# Altium project LM-002.PrjPcb
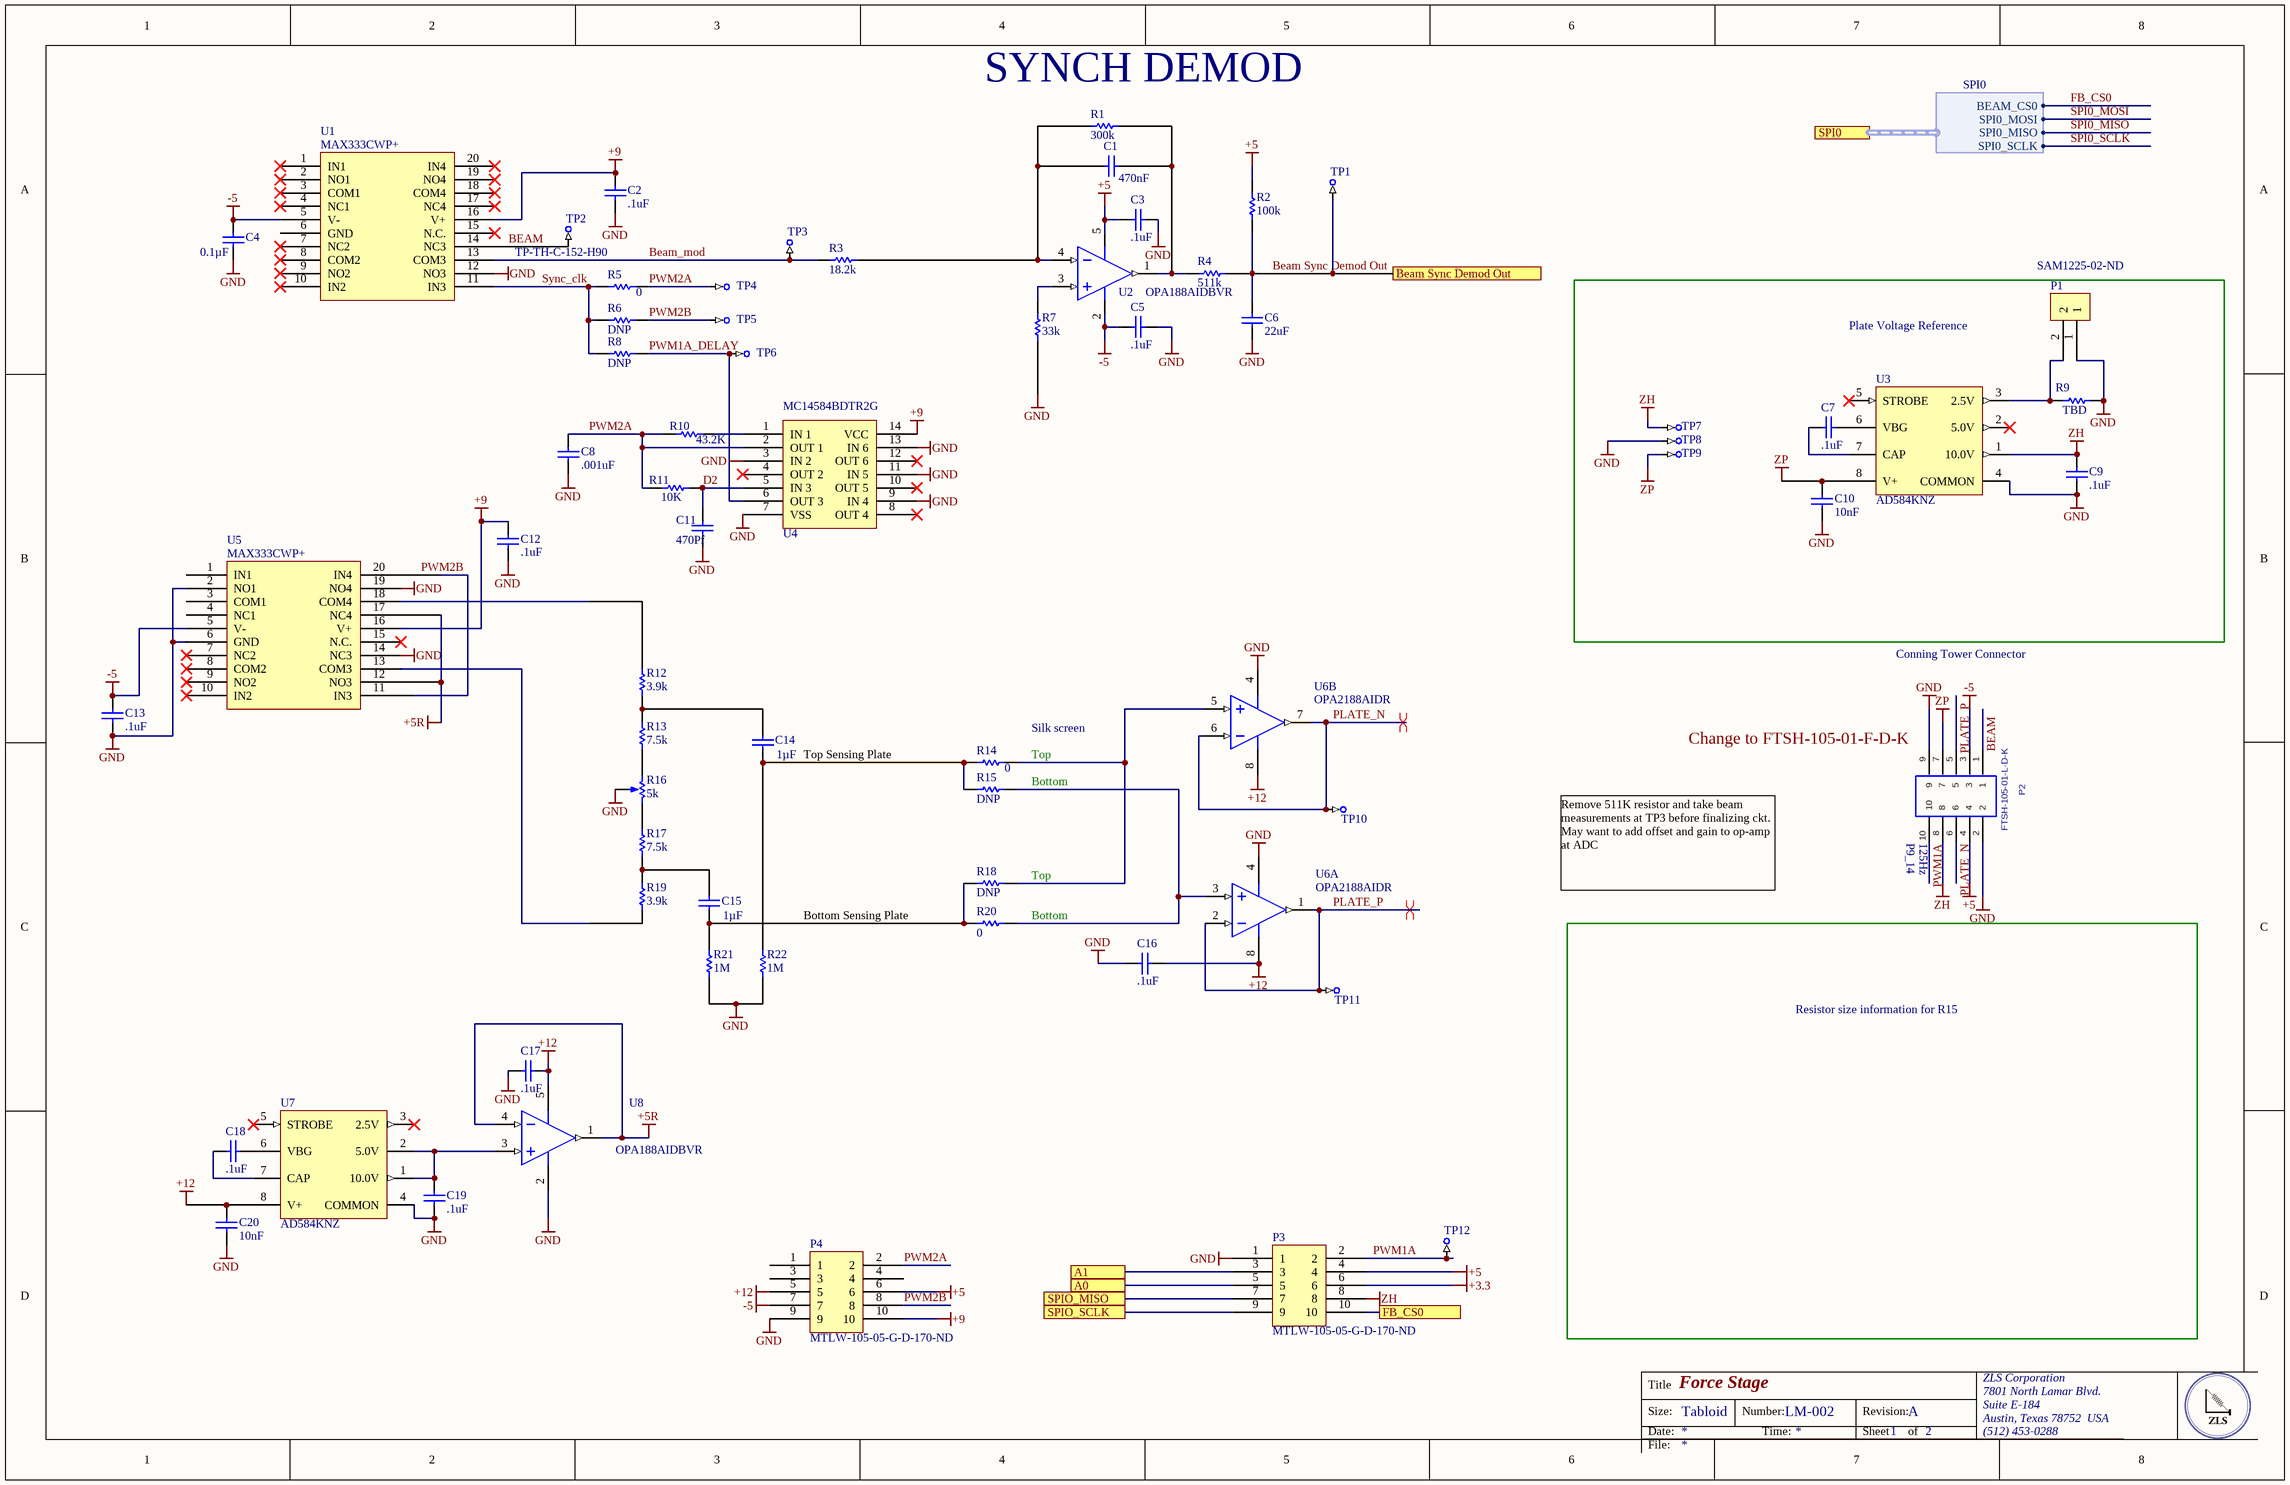
[diagram p0: Sheet1.SchDoc]
1 sheet, 66 parts. Net scope: flat (ports and power ports of the same name join across sheets).
Board file: PCB1.PcbDoc

## Sheet Sheet1.SchDoc: Force Stage
size Tabloid; DocumentNumber: LM-002; Revision: A; SheetNumber: 1; SheetTotal: 2; DocumentName: LM-002; ProjectName: LM-002

### Parts
C1  470nF  [CAPC0805(2012)75_L]
C2  .1uF  [CAPC0805(2012)75_L]
C3  .1uF  [CAPC0805(2012)75_L]
C4  Capacitance: 0.1µF  [CAPC0805(2012)145_N]  (hidden comment: CAP CER 0.1UF 25V X7R 0805)
C5  .1uF  [CAPC0805(2012)75_L]
C6  22uF  [CAPC0805(2012)75_L]
C7  .1uF  [CAPC0805(2012)75_M]
C8  .001uF  [CAPC0805(2012)75_L]
C9  .1uF  [CAPC0805(2012)75_M]
C10  Capacitance: 10nF  [CAPC0805(2012)145_N]  (hidden comment: Multilayer Ceramic Capacitors MLCC - SMD/SMT 0.01uF 50volts 10% X7R)
C11  470Pf  [CAPC0805(2012)75_L]
C12  .1uF  [CAPC0805(2012)75_M]
C13  .1uF  [CAPC0805(2012)75_M]
C14  Capacitance: 1µF  [CAPC0805(2012)155_L]  (hidden comment: CAP CER 1UF 25V X7R 0805)
C15  Capacitance: 1µF  [CAPC0805(2012)155_L]  (hidden comment: CAP CER 1UF 25V X7R 0805)
C16  .1uF  [CAPC0805(2012)75_M]
C17  .1uF  [CAPC0805(2012)75_M]
C18  .1uF  [CAPC0805(2012)75_M]
C19  .1uF  [CAPC0805(2012)75_M]
C20  Capacitance: 10nF  [CAPC0805(2012)145_N]  (hidden comment: Multilayer Ceramic Capacitors MLCC - SMD/SMT 0.01uF 50volts 10% X7R)
P1  Supplier Part Number 1: SAM1225-02-ND  [SSW-102-02-G-S-RA]  (hidden comment: SSW-102-02-G-S-RA)
P2  FTSH-105-01-L-D-K  [FTSH-105-01-XXX-D-K]
P3  Supplier Part Number 1: MTLW-105-05-G-D-170-ND  [TLW-105-05-G-D]  (hidden comment: TLW-105-05-G-D)
P4  Supplier Part Number 1: MTLW-105-05-G-D-170-ND  [TLW-105-05-G-D]  (hidden comment: TLW-105-05-G-D)
R1  300k  [RESC0805(2012)_L]
R2  100k  [RESC0805(2012)_L]
R3  18.2k  [RESC0805(2012)_L]
R4  511k  [RESC0805(2012)_L]
R5  0  [RESC0805(2012)_L]
R6  DNP  [RESC0805(2012)_L]
R7  33k  [RESC0805(2012)_L]
R8  DNP  [RESC0805(2012)_L]
R9  TBD  [VH102K]
R10  43.2K  [RESC0805(2012)_L]
R11  10K  [RESC0805(2012)_L]
R12  3.9k  [RESC0805(2012)_L]
R13  7.5k  [RESC0805(2012)_L]
R14  0  [RESC0805(2012)_L]
R15  DNP  [RESC0805(2012)_L]
R16  Resistance (Ohms): 5k  [Trimmer 2.54]  (hidden comment: TRIMMER 5K OHM 0.25W PC PIN)
R17  7.5k  [RESC0805(2012)_L]
R18  DNP  [RESC0805(2012)_L]
R19  3.9k  [RESC0805(2012)_L]
R20  0  [RESC0805(2012)_L]
R21  1M  [RESC0805(2012)_L]
R22  1M  [RESC0805(2012)_L]
TP1  TP-TH-C-152-H90  [TP-TH-C-152-H90]  (value not drawn)  (no BOM)
TP2  TP-TH-C-152-H90  [TP-TH-C-152-H90]  (no BOM)
TP3  TP-TH-C-152-H90  [TP-TH-C-152-H90]  (value not drawn)  (no BOM)
TP4  TP-TH-C-152-H90  [TP-TH-C-152-H90]  (value not drawn)  (no BOM)
TP5  TP-TH-C-152-H90  [TP-TH-C-152-H90]  (value not drawn)  (no BOM)
TP6  TP-TH-C-152-H90  [TP-TH-C-152-H90]  (value not drawn)  (no BOM)
TP7  TP-TH-C-152-H90  [TP-TH-C-152-H90]  (value not drawn)  (no BOM)
TP8  TP-TH-C-152-H90  [TP-TH-C-152-H90]  (value not drawn)  (no BOM)
TP9  TP-TH-C-152-H90  [TP-TH-C-152-H90]  (value not drawn)  (no BOM)
TP10  TP-TH-C-152-H90  [TP-TH-C-152-H90]  (value not drawn)  (no BOM)
TP11  TP-TH-C-152-H90  [TP-TH-C-152-H90]  (value not drawn)  (no BOM)
TP12  TP-TH-C-152-H90  [TP-TH-C-152-H90]  (value not drawn)  (no BOM)
U1  MAX333CWP+  [TSOP65P640X90-20N]
U2  OPA188AIDBVR  [DBV0005A_M]
U3  AD584KNZ  [ADI-N-8]
U4  MC14584BDTR2G  [MC14584BDTR2G]
U5  MAX333CWP+  [TSOP65P640X90-20N]
U6  OPA2188AIDR  [D0008A_L]  (parts A,B of 2)
U7  AD584KNZ  [ADI-N-8]
U8  OPA188AIDBVR  [DBV0005A_M]

### Blocks framed on the sheet
Plate Voltage Reference: C7 C9 C10 P1 R9 TP7-TP9 U3

### Ports
A0, A1, Beam Sync Demod Out, FB_CS0, SPI0 (harness SPI0), SPIO_MISO, SPIO_SCLK

### Harnesses
SPI0: BEAM_CS0, SPI0_MOSI, SPI0_MISO, SPI0_SCLK

### Nets
+3.3: P3.6
+5: C3.1 P2.4 P3.4 P4.6 R2.2 U2.5(V+)
+5R: U5.12(NO3) U5.17(NC4) U8.1(OUT) U8.4(IN-)
+9: C2.2 C12.2 P4.10 U1.16(V+) U4.14(VCC) U5.16(V+)
+12: C16.2 C17.2 C20.1 P4.5 U6.8(V+) U7.8(V+) U8.5(V+)
-5: C4.1 C5.1 C13.2 P2.3 P4.7 U1.5(V-) U2.2(V-) U5.5(V-)
GND: C2.1 C3.2 C4.2 C5.2 C6.1 C8.1 C9.1 C10.2 C11.1 C12.1 C13.1 C16.1 C17.1 C19.1 C20.2 P1.1 P2.2 P2.9 P3.1 P4.9 R7.1 R9.2 R16.2(b) R21.1 R22.1 TP8.1 U1.12(NO3) U3.4(COMMON) U4.3(IN_2) U4.7(VSS) U4.9(IN_4) U4.11(IN_5) U4.13(IN_6) U5.2(NO1) U5.6(GND) U5.14(NC3) U5.19(NO4) U6.4(V-) U7.4(COMMON) U8.2(V-)
ZH: C9.2 P2.8 P3.8 TP7.1 U3.1(10.0V)
ZP: C10.1 P2.7 TP9.1 U3.8(V+)
BEAM: P2.1 TP2.1 U1.14(NC3)
Beam Sync Demod Out: C6.2 R2.1 R4.1 TP1.1 ; port Beam Sync Demod Out
Beam_mod: R3.2 TP3.1 U1.13(COM3)
D2: C11.2 R11.1 U4.5(IN_3)
FB_CS0: port SPI0.BEAM_CS0
PLATE_N: P2.6 TP10.1 U6.6(IN_B-) U6.7(OUT_B)
PLATE_P: P2.5 TP11.1 U6.1(OUT_A) U6.2(IN_A-)
PWM1A: P2.10 P3.2 TP12.1
PWM1A_DELAY: R8.1 TP6.1 U4.6(OUT_3)
PWM2A: C8.2 P4.2 R5.1 R10.2 R11.2 TP4.1 U4.2(OUT_1)
PWM2B: P4.8 R6.1 TP5.1 U5.11(IN3) U5.20(IN4)
SPI0_MISO: port SPI0.SPI0_MISO
SPI0_MOSI: port SPI0.SPI0_MOSI
SPI0_SCLK: port SPI0.SPI0_SCLK
Sync_clk: R5.2 R6.2 R8.2 U1.11(IN3)
NetC1_1: C1.1 R1.2 R3.1 U2.4(IN-)
NetC1_2: C1.2 R1.1 R4.2 U2.1(OUT)
NetC7_1: C7.1 U3.7(CAP)
NetC7_2: C7.2 U3.6(VBG)
NetC14_1: C14.1 R14.2 R15.2 R22.2
NetC14_2: C14.2 R12.1 R13.2
NetC15_1: C15.1 R18.2 R20.2 R21.2
NetC15_2: C15.2 R17.1 R19.2
NetC18_1: C18.1 U7.7(CAP)
NetC18_2: C18.2 U7.6(VBG)
NetC19_2: C19.2 U7.1(10.0V) U7.2(5.0V) U8.3(IN+)
NetP1_2: P1.2 R9.1 U3.3(2.5V)
NetP3_3: P3.3 ; port A1
NetP3_5: P3.5 ; port A0
NetP3_7: P3.7 ; port SPIO_MISO
NetP3_9: P3.9 ; port SPIO_SCLK
NetP3_10: P3.10 ; port FB_CS0
NetR7_2: R7.2 U2.3(IN+)
NetR10_1: R10.1 U4.1(IN_1)
NetR12_2: R12.2 U5.18(COM4)
NetR13_1: R13.1 R16.1(a)
NetR14_1: R14.1 R18.1 U6.5(IN_B+)
NetR15_1: R15.1 R20.1 U6.3(IN_A+)
NetR16_3: R16.3(c) R17.2
NetR19_1: R19.1 U5.13(COM3)

Not connected (* = marked no-connect by the designer): P4 1 3 4; U1 1(IN1)* 2(NO1)* 3(COM1)* 4(NC1)* 6(GND) 7(NC2)* 8(COM2)* 9(NO2)* 10(IN2)* 15(N.C.)* 17(NC4)* 18(COM4)* 19(NO4)* 20(IN4)*; U3 2(5.0V)* 5(STROBE)*; U4 4(OUT_2)* 8(OUT_4)* 10(OUT_5)* 12(OUT_6)*; U5 1(IN1) 3(COM1) 4(NC1) 7(NC2)* 8(COM2)* 9(NO2)* 10(IN2)* 15(N.C.)*; U7 3(2.5V)* 5(STROBE)*

### Layout directives
differential pair: PLATE_N, PLATE_P

### Notes on the sheet
- (near R1) SYNCH DEMOD
- Conning Tower Connector
- (near C14) Top Sensing Plate
- Silk screen
- Top
- (near P2) Change to FTSH-105-01-F-D-K
- Bottom
- (near P2) P9_14
- (near P2) 125Hz
- (near R18) Top
- Remove 511K resistor and take beam measurements at TP3 before finalizing ckt.
  May want to add offset and gain to op-amp at ADC
- Bottom Sensing Plate
- Resistor size information for R15
- Title
- Size:
- Date:
- Tabloid
- Number:
- Time:
- Revision:
- Sheet
- of
- ZLS Corporation
- 7801 North Lamar Blvd.
- Suite E-184
- Austin, Texas 78752  USA
- (512) 453-0288
- File:

### Library data of the parts
C1 = CMP-1036-02117-1: CAP 150pF 16V ±10% 0805 (2012 Metric) Thickness 0.75mm SMD; Case-EIA: 0805; Tolerance: Â±10%; Value: .47uF; Case-Metric: 2012; Technology: SMT; Max Thickness: 0.75 mm; Rated Voltage: 16 V
C2 C3 C5 C6 C8 C11 = CMP-1036-02117-1: CAP 150pF 16V ±10% 0805 (2012 Metric) Thickness 0.75mm SMD; Case-EIA: 0805; Tolerance: Â±10%; Case-Metric: 2012; Technology: SMT; Max Thickness: 0.75 mm; Rated Voltage: 16 V
  C2 C3 C5: Value: .1uF
  C6: Value: 22uF
  C8: Value: .001uF
  C11: Value: 470Pf
C4 = CMP-1036-04795-1: Manufacturer: Murata Electronics North America; Manufacturer Part Number: GRM21BR71E104KA01L; Tolerance: ±10%; Supplier 1: Digi-Key; Supplier Part Number 1: 490-1673-6-ND; RoHS: RoHS Compliant; Category: Capacitors; Stock 1: 891652; Pricing 1: 1=0.2, 10=0.145, 100=0.0683, 500=0.04788, 1000=0.03964 (USD); Packaging: Digi-Reel®; Part Status: Active; Voltage - Rated: 25V; Temperature Coefficient: X7R; Operating Temperature: -55°C ~ 125°C; Features: -; Ratings: -; Applications: General Purpose; Mounting Type: Surface Mount, MLCC; Package / Case: 0805 (2012 Metric); Size / Dimension: 0.079" L x 0.049" W (2.00mm x 1.25mm); Height - Seated (Max): -; Thickness (Max): 0.053" (1.35mm); Lead Spacing: -; Lead Style: -; ComponentLink1URL: http://www.murata.com/~/media/webrenewal/support/library/catalog/products/capacitor/mlcc/c02e.ashx; ComponentLink1Description: http://www.murata.com/~/media/webrenewal/support/library/catalog/products/capacitor/mlcc/c02e.ashx
C7 C9 C12 C13 C16-C19 = CMP-1036-01414-1: CAP 33pF 25V ±2% 0805 (2012 Metric) Thickness 0.75mm SMD; Tolerance: Â±2%; Case-Metric: 2012; Case-EIA: 0805; Value: .1uF; Max Thickness: 0.75 mm; Rated Voltage: 25 V; Technology: SMT
C10 C20 = CMP-1036-04795-1: Manufacturer: Kemet; Manufacturer Part Number: C0805C103K5RACAUTO; Voltage Rating: 50V; Supplier 1: Digi-Key; Supplier Part Number 1: 399-6924-1-ND; Stock 1: 63236; Pricing 1: 1=0.12, 10=0.087, 100=0.041, 500=0.0287, 1000=0.0238 (USD); Mount: Surface Mount; Case/Package: 0805; Case Code (Metric): 2012; Case Code (Imperial): 0805; Dielectric Material: Ceramic; Contact Plating: Tin; Min Operating Temperature: -55°C; Max Operating Temperature: 125°C; Tolerance: 10%; Packaging: Tape and Reel; Package Quantity: 1; Voltage Rating (DC): 50V; Dielectric: X7R; Termination: SMD/SMT; Length: 2mm; Height: 0.78mm; Width: 0.049inch; Thickness: 0.035inch; Depth: 1.25mm; Radiation Hardening: No; REACH SVHC: No SVHC; ComponentLink1URL: https://datasheet.ciiva.com/22700/1693454-22700519.pdf; ComponentLink1Description: https://datasheet.ciiva.com/22700/1693454-22700519.pdf; ComponentLink2URL: https://datasheet.ciiva.com/7842/1693454-7842175.pdf; ComponentLink2Description: https://datasheet.ciiva.com/7842/1693454-7842175.pdf
C14 C15 = CMP-1036-04882-1: Manufacturer: Murata Electronics North America; Manufacturer Part Number: GRM21BR71E105KA99L; Tolerance: ±10%; Supplier 1: Digi-Key; Supplier Part Number 1: 490-6484-6-ND; RoHS: RoHS Compliant; Category: Capacitors; Stock 1: 295074; Pricing 1: 1=0.14, 10=0.099, 100=0.0468, 500=0.0328, 1000=0.02715 (USD); Packaging: Digi-Reel®; Part Status: Active; Voltage - Rated: 25V; Temperature Coefficient: X7R; Operating Temperature: -55°C ~ 125°C; Features: -; Ratings: -; Applications: General Purpose; Mounting Type: Surface Mount, MLCC; Package / Case: 0805 (2012 Metric); Size / Dimension: 0.079" L x 0.049" W (2.00mm x 1.25mm); Height - Seated (Max): -; Thickness (Max): 0.053" (1.35mm); Lead Spacing: -; Lead Style: -; ComponentLink1URL: http://www.murata.com/~/media/webrenewal/support/library/catalog/products/capacitor/mlcc/c02e.ashx; ComponentLink1Description: http://www.murata.com/~/media/webrenewal/support/library/catalog/products/capacitor/mlcc/c02e.ashx
P2 = FTSH-105-01-XXX-D-K: TERMINAL STRIP, .050"(1.27mm) PITCH, 10 PINS, KEYING OPTION.; MANUFACTURER: SAMTEC; PCB DECAL: FTSH-105-01-F-DV-K; CREATED: September 26, 2016 - Wendy Xin
P3 P4 = TLW-105-05-G-D: Manufacturer: Samtec Inc.; Manufacturer Part Number: MTLW-105-05-G-D-170; Connector Type: Header; Pitch - Mating: 0.100" (2.54mm); Number of Positions: 10; Number of Positions Loaded: All; Style: Board to Board or Cable; Shrouding: Unshrouded; Contact Length - Mating: 0.170" (4.32mm); Contact Length - Post: 0.105" (2.67mm); Overall Contact Length: 0.335" (8.51mm); Material Flammability Rating: UL94 V-0; Current Rating: 5.2A per Contact; Supplier 1: Digi-Key; RoHS: RoHS Compliant; Category: Connectors, Interconnects; Stock 1: 0; Pricing 1: 1=1.79 (USD); Packaging: Tube; Part Status: Active; Contact Type: Male Pin; Number of Rows: 2; Row Spacing - Mating: 0.100" (2.54mm); Mounting Type: Through Hole; Termination: Solder; Fastening Type: Push-Pull; Insulation Height: 0.060" (1.52mm); Contact Shape: Square; Contact Finish - Mating: Gold; Contact Finish Thickness - Mating: 10µin (0.25µm); Contact Finish - Post: Gold; Contact Material: Phosphor Bronze; Insulation Material: Liquid Crystal Polymer (LCP); Features: -; Operating Temperature: -55°C ~ 125°C; Ingress Protection: -; Insulation Color: Black; Voltage Rating: -; Mated Stacking Heights: -; Contact Finish Thickness - Post: 3µin (0.08µm); Applications: -; ComponentLink1URL: http://suddendocs.samtec.com/prints/mtlw-1xx-xx-xx-x-xxx-xx-xx-mkt1.pdf; ComponentLink1Description: http://suddendocs.samtec.com/prints/mtlw-1xx-xx-xx-x-xxx-xx-xx-mkt1.pdf
R1-R5 R7 R10-R14 R17 R19-R22 = CMP-1013-00215-1: 2R55 0.125W 1% 0805 (2012 Metric)  SMD; Case-Metric: 2012; Case-EIA: 0805; Tolerance: 1 %; Technology: SMT; Power: 0.125 W
  R1: Value: 300k
  R2: Value: 100k
  R3: Value: 18.2k
  R4: Value: 511k
  R5 R14 R20: Value: 0
  R7: Value: 33k
  R10: Value: 43.2K
  R11: Value: 10K
  R12 R19: Value: 3.9k
  R13 R17: Value: 7.5k
  R21 R22: Value: 1M
R6 R8 R15 R18 = CMP-1013-00215-1: 2R55 0.125W 1% 0805 (2012 Metric)  SMD; Case-Metric: 2012; Value: 0; Case-EIA: 0805; Tolerance: 1 %; Technology: SMT; Power: 0.125 W
R9 = CMP-1013-00393-1
R16 = Trimmer: Manufacturer: Vishay Foil Resistors (Division of Vishay Precision Group); Manufacturer Part Number: Y00535K00000J0L; Power (Watts): 0.25W, 1/4W; Tolerance: ±5%; Temperature Coefficient: ±10ppm/°C; Number of Turns: 21; Adjustment Type: Side Adjustment; Resistive Material: Metal Foil; Supplier 1: Digi-Key; Supplier Part Number 1: 804-1020-ND; RoHS: RoHS Compliant; Category: Potentiometers, Variable Resistors; Stock 1: 679; Pricing 1: 1=34.42, 10=32.265, 25=26.5292, 50=22.944, 100=22.227, 250=20.793, 500=19.2156 (USD); Packaging: Bulk; Part Status: Active; Mounting Type: Through Hole; Termination Style: PC Pins; Size / Dimension: Rectangular - 0.250" x 0.175" Face x 0.250" L (6.35mm x 4.45mm x 6.35mm); ComponentLink1URL: http://www.vishaypg.com/docs/63053/1240.pdf; ComponentLink1Description: http://www.vishaypg.com/docs/63053/1240.pdf
TP1-TP12 = CMP-0484-00003-2: Test Point, Through Hole, Hole Size 0.9 mm, PCB Mount with Silkscreen Box; Manufacturer: No Vendor; PartNumber: TP-TH-C-152-H90
U1 U5 = MAX333CWP+: IC SWITCH QUAD SPDT 20TSSOP; Manufacturer: Maxim; Manufacturer Part Number: MAX333AEUP+; Max Supply Voltage: 30V; Min Supply Voltage: 10V; Min Dual Supply Voltage: 4.5V; Max Dual Supply Voltage: 20V; On-State Resistance: 35R; Operating Supply Current: 1uA; Supply Type: Single,Dual; Max Power Dissipation: 559mW; Turn-On Delay Time: 175ns; Turn-Off Delay Time: 145ns; Max Supply Current: 250uA; Number of Bits: 4; Dual Supply Voltage: 15V; Supplier 1: Mouser; Supplier Part Number 1: 700-MAX333AEUP; Stock 1: 664; Pricing 1: 1=6.77, 10=6.43, 50=5.8, 100=5.8, 1000=5.62, 10000=5.62 (USD); Case/Package: TSSOP; Number of Pins: 20; Weight: 0.006737oz; Min Operating Temperature: -40°C; Max Operating Temperature: 85°C; Packaging: Rail/Tube; Package Quantity: 74; Throw Configuration: SPDT; Number of Channels: 4; Length: 6.6mm; Height: 0.95mm; Width: 4.5mm; Radiation Hardening: No; Lead Free: Lead Free; REACH SVHC: Unknown; ComponentLink1URL: https://datasheet.ciiva.com/2978/max333a-2978850.pdf; ComponentLink1Description: https://datasheet.ciiva.com/2978/max333a-2978850.pdf; ComponentLink2URL: https://datasheet.ciiva.com/30478/0900766b81253c85-30478260.pdf; ComponentLink2Description: https://datasheet.ciiva.com/30478/0900766b81253c85-30478260.pdf; ComponentLink3URL: https://datasheet.ciiva.com/1674/max333a-1674617.pdf; ComponentLink3Description: https://datasheet.ciiva.com/1674/max333a-1674617.pdf; ComponentLink4URL: https://datasheet.ciiva.com/26825/max333aeup-26825546.pdf; ComponentLink4Description: https://datasheet.ciiva.com/26825/max333aeup-26825546.pdf
U2 U8 = CMP-0809-00005-2: Precision, Low Noise, Rail-to-Rail Output, Zero-Drift Operational Amplifier, 4 to 36 V, -40 to 125 degC, 5-pin SOT23 (DBV5), Green (RoHS & no Sb/Br); Manufacturer: Texas Instruments; Total Supply Voltage(Min)(+5V is 5, +/-5V is 10): 4; Offset Drift(Typ)(uV/C): 0.03; Rating: Catalog; SubFamily: Zero Drift Precision Amplifier; GBW(Typ)(MHz): 2; Slew Rate(Typ)(V/us): 0.8; Number of Channels: 1; CMRR(Min)(dB): 120; Iq per channel(Max)(mA): 0.51; Total Supply Voltage(Max)(+5V is 5, +/-5V is 10): 36; PartNumber: OPA188AIDBVR; ComponentLink2Description: Datasheet; ComponentLink2URL: http://www.ti.com/lit/ds/symlink/opa188.pdf; ComponentLink1Description: Manufacturer URL; Mounting Technology: Surface Mount; Eco-Plan: Green (RoHS & no Sb/Br); ComponentLink1URL: http://www.ti.com/; PackageVersion: 4073253-4/K, 03/2006; DatasheetVersion: SBOS642A; ComponentLink3Description: Package Specification; PackageReference: DBV0005A; ComponentLink3URL: http://www.ti.com/litv/pdf/mpds018i; PackageDescription: 5-Pin Plastic Small Outline, Body 1.6 x 2.9 mm, Pitch 0.95 mm; Code_JEDEC: MO-178
U3 U7 = CMP-0784-00054-1: Pin Programmable, Precision Voltage Reference, + 2.5 / + 5 / + 7.5 / + 10 Prog V Output, 4.5 to 30 V Supply, Commercial, 8-pin DIP (N-8), Tube; Manufacturer: Analog Devices; Max V Supply (V): 30; Min V Supply (V): 4.5; Ref Out TC (ppm/C): 15; Vout: 2.5V, 5V, 7.5V, 10V; ComponentLink3URL: http:/www.analog.com/static/imported-files/packages/PKG_PDF/PDIP(N)/N_8.pdf; ComponentLink1URL: http://www.analog.com/en/index.html; PartNumber: AD584KNZ; ComponentLink1Description: Manufacturer URL; ComponentLink2Description: Datasheet; PackageDescription: 8-Pin Plastic Dual In-Line Package, Row spacing 7.62 mm, Pitch 2.54 mm; Operating Temp Range: 0 to 70 degC; DatasheetVersion: Rev. C; Code_JEDEC: MS-001; Packing: Tube; ComponentLink3Description: Package Specification; PackageReference: N-8; ComponentLink4Description: URL Link1; Mounting Technology: Through Hole; PackageVersion: 070606-A, 07/2006; ComponentLink4URL: Product URL:http://www.analog.com/en/special-linear-functions/voltage-references/ad584/products/product.html; ComponentLink2URL: http://www.analog.com/static/imported-files/data_sheets/AD584.pdf
U4 = MC14584BDTR2G: Manufacturer: ON Semiconductor; Logic Type: Inverter; Number of Inputs: 6; Voltage - Supply: 3 V ~ 18 V; Current - Output High, Low: 8.8mA, 8.8mA; Logic Level - Low: 1.6 V ~ 4.6 V; Logic Level - High: 3.4 V ~ 10.5 V; Max Propagation Delay @ V, Max CL: 80ns @ 15V, 50pF; Supplier 1: Digi-Key; Supplier Part Number 1: MC14584BDTR2GOSCT-ND; Manufacturer Part Number: MC14584BDTR2G; RoHS: RoHS Compliant; Category: Integrated Circuits (ICs); Stock 1: 5429; Pricing 1: 1=0.5, 10=0.43, 100=0.3213, 500=0.25242, 1000=0.19506 (USD); Packaging: Cut Tape (CT); Part Status: Active; Features: Schmitt Trigger; Operating Temperature: -55°C ~ 125°C; Mounting Type: Surface Mount; Supplier Device Package: 14-TSSOP; Package / Case: 14-TSSOP (0.173", 4.40mm Width); Base Part Number: 4584; ComponentLink1URL: http://www.onsemi.com/pub/Collateral/MC14584B-D.PDF; ComponentLink1Description: http://www.onsemi.com/pub/Collateral/MC14584B-D.PDF
U6 = CMP-0272-00241-3: 0.03 uV/degC, 6 uV Vos, Low Noise, Rail-to-Rail Output, Zero-Drift Operational Amplifier, 4 to 36 V, -40 to 105 degC, 8-pin SOIC (D8), Green (RoHS & no Sb/Br); Manufacturer: Texas Instruments; Number of Circuits: 2; Slew Rate: 0.8 V/µs; Current - Supply: 415µA; Current - Output / Channel: 18mA; Voltage - Supply, Single/Dual (±): 4 V ~ 36 V, ±2 V ~ 18 V; Supplier 1: Digi-Key; Supplier Part Number 1: 296-29454-6-ND; Manufacturer Part Number: OPA2188AIDR; RoHS: RoHS Compliant; Category: Integrated Circuits (ICs); Stock 1: 8272; Pricing 1: 1=3.44, 10=3.089, 100=2.5307, 500=2.15434, 1000=1.81692 (USD); Packaging: Digi-Reel®; Part Status: Active; Amplifier Type: Zero-Drift; Output Type: Rail-to-Rail; -3db Bandwidth: -; Operating Temperature: -40°C ~ 105°C; Mounting Type: Surface Mount; Package / Case: 8-SOIC (0.154", 3.90mm Width); Supplier Device Package: 8-SOIC; ComponentLink1URL: http://www.ti.com/lit/ds/symlink/opa2188.pdf; ComponentLink1Description: http://www.ti.com/lit/ds/symlink/opa2188.pdf
P1 = SSW-102-02-G-S-RA: Supplier 1: Digi-Key